# EAGLE design CON_Board_v1 (EAGLE 7.3.0)
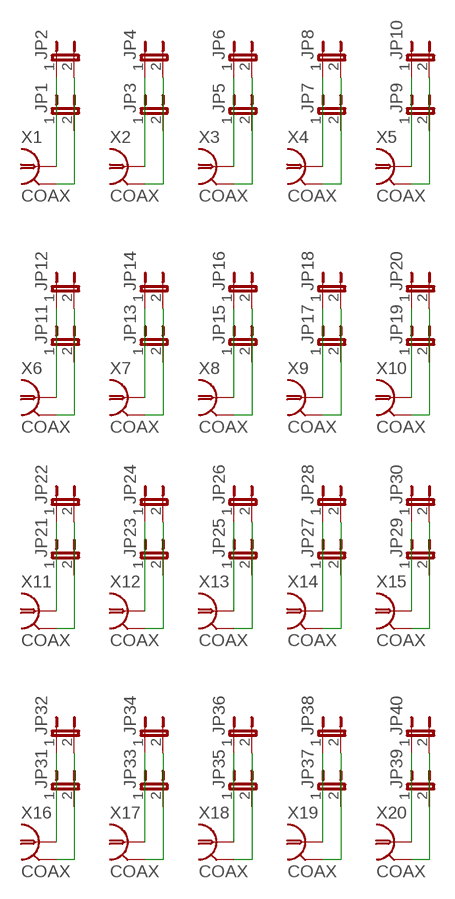
[diagram p0: schematic, sheet 1]

## Parts
JP1  JP1E  [JP1]
JP2  JP1E  [JP1]
JP3  JP1E  [JP1]
JP4  JP1E  [JP1]
JP5  JP1E  [JP1]
JP6  JP1E  [JP1]
JP7  JP1E  [JP1]
JP8  JP1E  [JP1]
JP9  JP1E  [JP1]
JP10  JP1E  [JP1]
JP11  JP1E  [JP1]
JP12  JP1E  [JP1]
JP13  JP1E  [JP1]
JP14  JP1E  [JP1]
JP15  JP1E  [JP1]
JP16  JP1E  [JP1]
JP17  JP1E  [JP1]
JP18  JP1E  [JP1]
JP19  JP1E  [JP1]
JP20  JP1E  [JP1]
JP21  JP1E  [JP1]
JP22  JP1E  [JP1]
JP23  JP1E  [JP1]
JP24  JP1E  [JP1]
JP25  JP1E  [JP1]
JP26  JP1E  [JP1]
JP27  JP1E  [JP1]
JP28  JP1E  [JP1]
JP29  JP1E  [JP1]
JP30  JP1E  [JP1]
JP31  JP1E  [JP1]
JP32  JP1E  [JP1]
JP33  JP1E  [JP1]
JP34  JP1E  [JP1]
JP35  JP1E  [JP1]
JP36  JP1E  [JP1]
JP37  JP1E  [JP1]
JP38  JP1E  [JP1]
JP39  JP1E  [JP1]
JP40  JP1E  [JP1]
X1  COAX  31-5329-52RFX31-5329-52RFX  [31-5329]
X2  COAX  31-5329-52RFX31-5329-52RFX  [31-5329]
X3  COAX  31-5329-52RFX31-5329-52RFX  [31-5329]
X4  COAX  31-5329-52RFX31-5329-52RFX  [31-5329]
X5  COAX  31-5329-52RFX31-5329-52RFX  [31-5329]
X6  COAX  31-5329-52RFX31-5329-52RFX  [31-5329]
X7  COAX  31-5329-52RFX31-5329-52RFX  [31-5329]
X8  COAX  31-5329-52RFX31-5329-52RFX  [31-5329]
X9  COAX  31-5329-52RFX31-5329-52RFX  [31-5329]
X10  COAX  31-5329-52RFX31-5329-52RFX  [31-5329]
X11  COAX  31-5329-52RFX31-5329-52RFX  [31-5329]
X12  COAX  31-5329-52RFX31-5329-52RFX  [31-5329]
X13  COAX  31-5329-52RFX31-5329-52RFX  [31-5329]
X14  COAX  31-5329-52RFX31-5329-52RFX  [31-5329]
X15  COAX  31-5329-52RFX31-5329-52RFX  [31-5329]
X16  COAX  31-5329-52RFX31-5329-52RFX  [31-5329]
X17  COAX  31-5329-52RFX31-5329-52RFX  [31-5329]
X18  COAX  31-5329-52RFX31-5329-52RFX  [31-5329]
X19  COAX  31-5329-52RFX31-5329-52RFX  [31-5329]
X20  COAX  31-5329-52RFX31-5329-52RFX  [31-5329]

## Nets
N$1: JP1.1 JP2.1 X1.1
N$2: JP1.2 JP2.2 X1.2 X1.3 X1.4 X1.5
N$3: JP3.1 JP4.1 X2.1
N$4: JP3.2 JP4.2 X2.2 X2.3 X2.4 X2.5
N$5: JP5.1 JP6.1 X3.1
N$6: JP5.2 JP6.2 X3.2 X3.3 X3.4 X3.5
N$7: JP7.1 JP8.1 X4.1
N$8: JP7.2 JP8.2 X4.2 X4.3 X4.4 X4.5
N$9: JP9.1 JP10.1 X5.1
N$10: JP9.2 JP10.2 X5.2 X5.3 X5.4 X5.5
N$11: JP11.1 JP12.1 X6.1
N$12: JP11.2 JP12.2 X6.2 X6.3 X6.4 X6.5
N$13: JP13.1 JP14.1 X7.1
N$14: JP13.2 JP14.2 X7.2 X7.3 X7.4 X7.5
N$15: JP15.1 JP16.1 X8.1
N$16: JP15.2 JP16.2 X8.2 X8.3 X8.4 X8.5
N$17: JP17.1 JP18.1 X9.1
N$18: JP17.2 JP18.2 X9.2 X9.3 X9.4 X9.5
N$19: JP19.1 JP20.1 X10.1
N$20: JP19.2 JP20.2 X10.2 X10.3 X10.4 X10.5
N$21: JP21.1 JP22.1 X11.1
N$22: JP21.2 JP22.2 X11.2 X11.3 X11.4 X11.5
N$23: JP23.1 JP24.1 X12.1
N$24: JP23.2 JP24.2 X12.2 X12.3 X12.4 X12.5
N$25: JP25.1 JP26.1 X13.1
N$26: JP25.2 JP26.2 X13.2 X13.3 X13.4 X13.5
N$27: JP27.1 JP28.1 X14.1
N$28: JP27.2 JP28.2 X14.2 X14.3 X14.4 X14.5
N$29: JP29.1 JP30.1 X15.1
N$30: JP29.2 JP30.2 X15.2 X15.3 X15.4 X15.5
N$31: JP31.1 JP32.1 X16.1
N$32: JP31.2 JP32.2 X16.2 X16.3 X16.4 X16.5
N$33: JP33.1 JP34.1 X17.1
N$34: JP33.2 JP34.2 X17.2 X17.3 X17.4 X17.5
N$35: JP35.1 JP36.1 X18.1
N$36: JP35.2 JP36.2 X18.2 X18.3 X18.4 X18.5
N$37: JP37.1 JP38.1 X19.1
N$38: JP37.2 JP38.2 X19.2 X19.3 X19.4 X19.5
N$39: JP39.1 JP40.1 X20.1
N$40: JP39.2 JP40.2 X20.2 X20.3 X20.4 X20.5

## Library data of the parts
JP1-JP40 = jumper:JP1E: JUMPER
X1-X20 = Amphenol-coax-connector:31-5329-52RFX; OC_FARNELL: unknown; OC_NEWARK: unknown

## Board
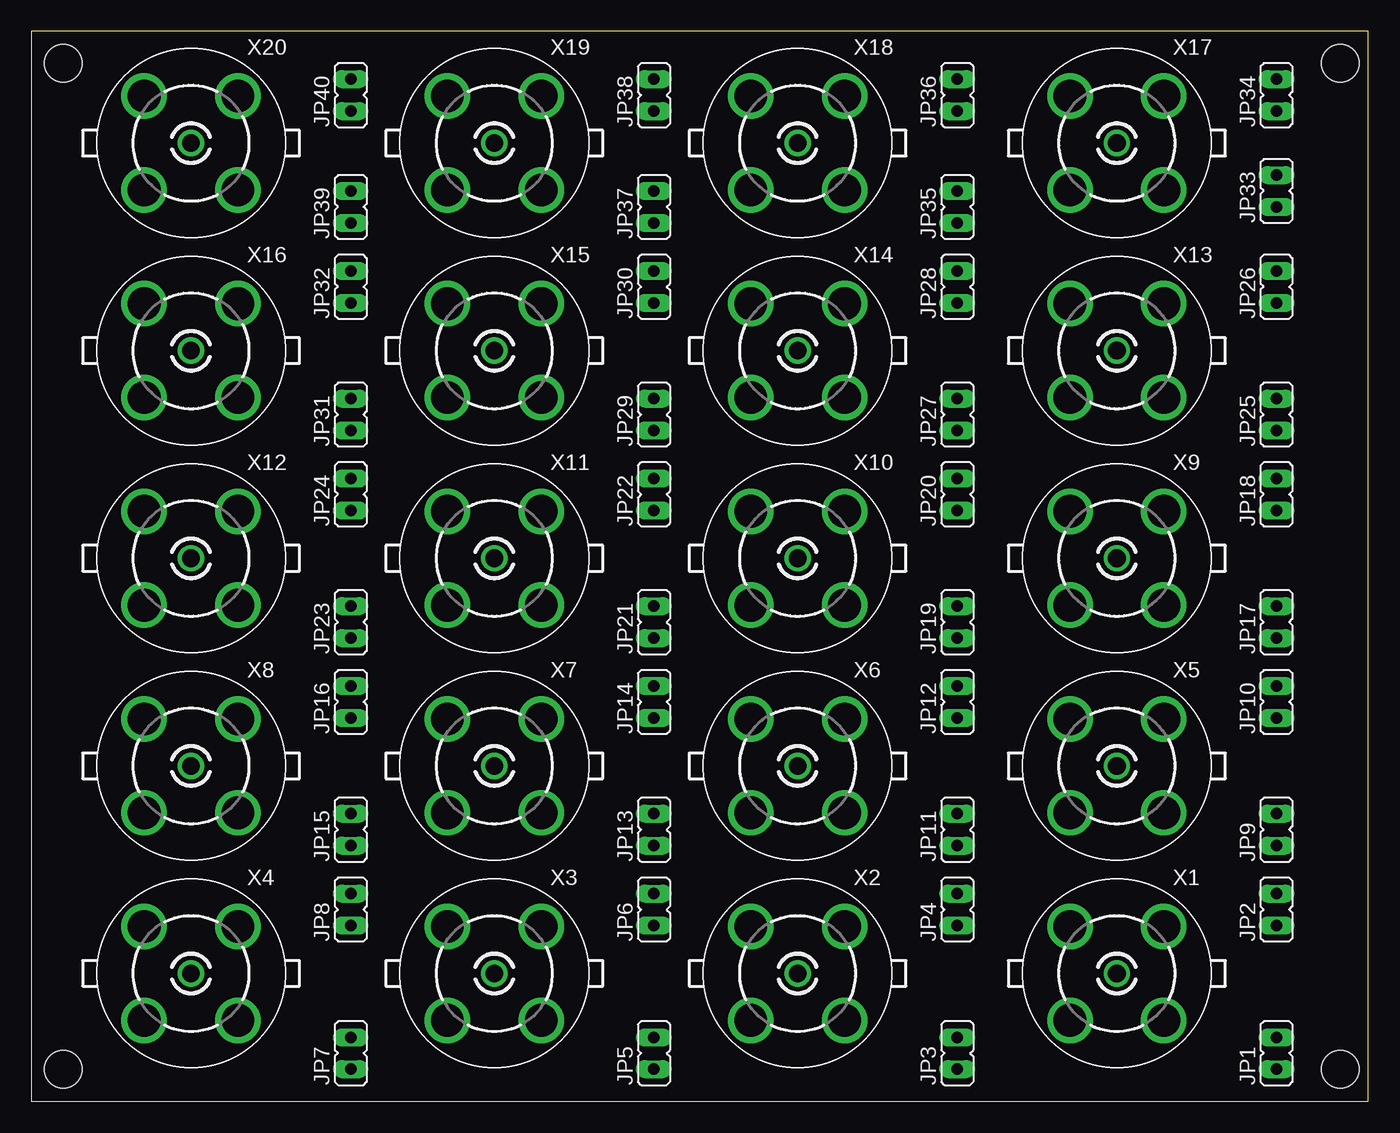
[diagram p1: board, top side]
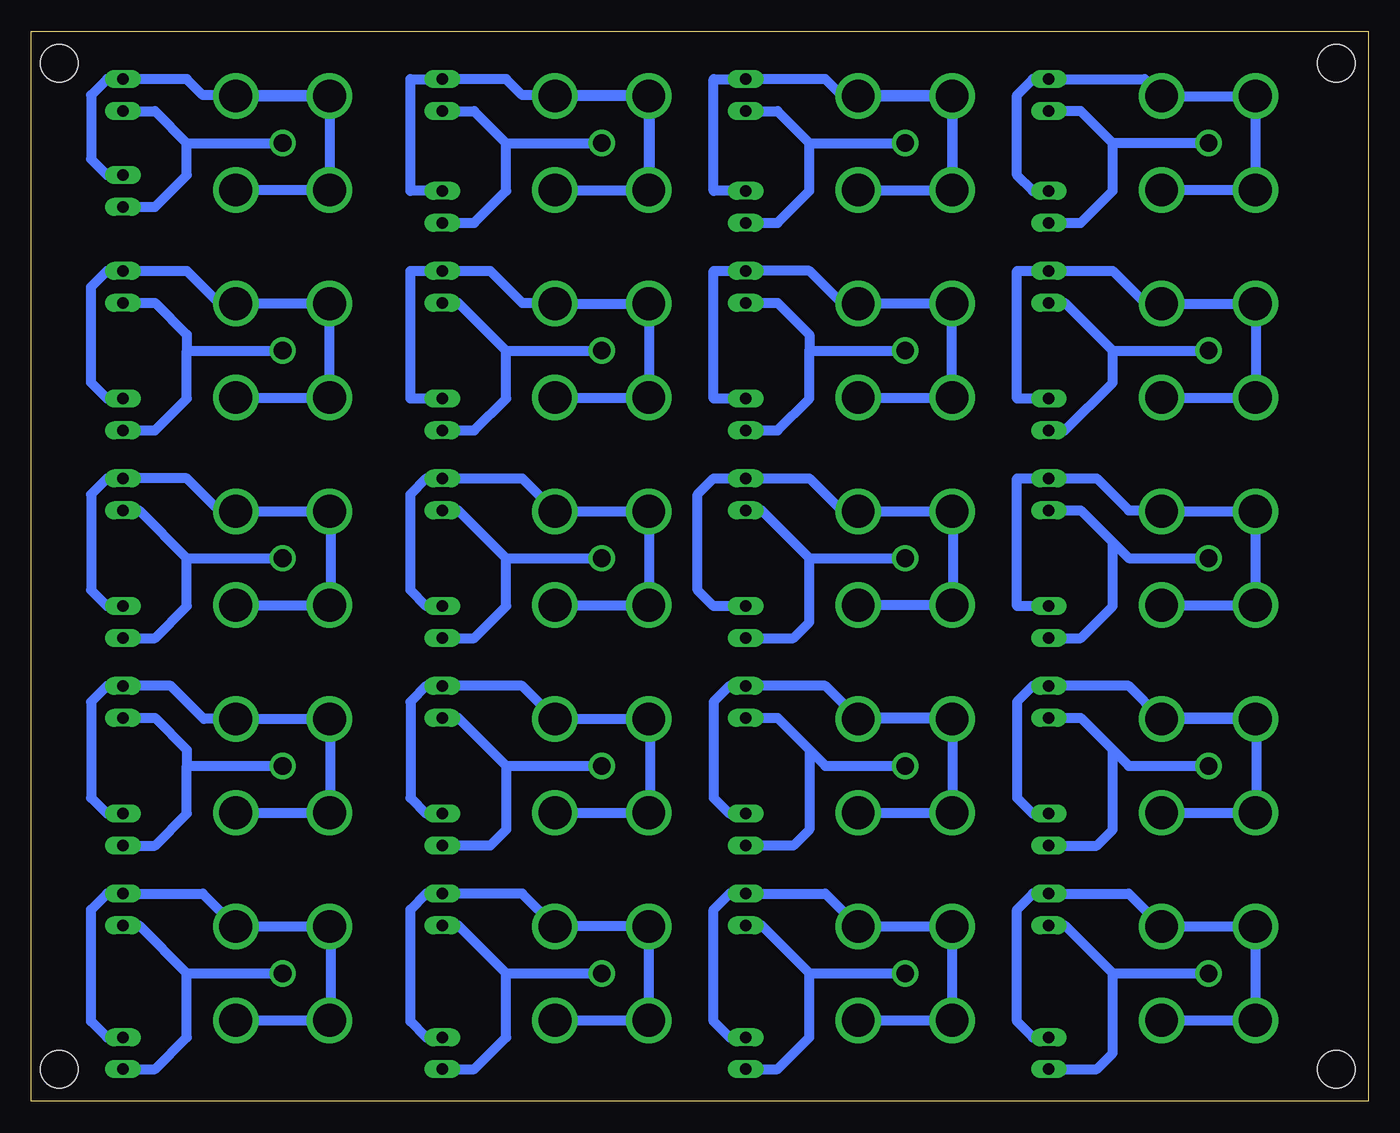
[diagram p2: board, bottom side, seen from below]

Size 106.35 x 85.08 mm. Coordinates in mm from the lower left corner, seen from the top.
Outline: 0,0 106.35,0 106.35,85.08 0,85.08 0,0
Copper layers (1*16): Top 0.035mm / dielectric 1.5mm / Bottom 0.035mm
Design rules "default": minimum track width 10mil, minimum drill 24mil, track to track 8mil, track to pad 8mil, pad to pad 8mil, via to via 8mil, smd to smd 8mil, copper to edge 40mil, drill to drill 8mil, minimum pad ring 10mil, minimum via ring 8mil, stop-mask expansion 4mil, vias tented up to drill 0mil, thermal gap 10mil
Holes 3 mm at 104.14,82.55 104.14,2.54 2.54,82.55 2.54,2.54

### Footprints (pad centres in the part's own frame; a part is rotated, then mirrored left to right if it is on the bottom)
JP1 = drill 0.914 long: 1 0,-1.27; 2 0,1.27
31-5329 = drill 1.4: 1 0,0 | drill 2.6: 2 3.734,3.734; 3 -3.734,3.734; 4 -3.734,-3.734; 5 3.734,-3.734

### Placement (x,y rotation side)
JP1  99.06,3.81 0 top
JP2  99.06,15.24 0 top
JP3  73.66,3.81 0 top
JP4  73.66,15.24 0 top
JP5  49.53,3.81 0 top
JP6  49.53,15.24 0 top
JP7  25.4,3.81 0 top
JP8  25.4,15.24 0 top
JP9  99.06,21.59 0 top
JP10  99.06,31.75 0 top
JP11  73.66,21.59 0 top
JP12  73.66,31.75 0 top
JP13  49.53,21.59 0 top
JP14  49.53,31.75 0 top
JP15  25.4,21.59 0 top
JP16  25.4,31.75 0 top
JP17  99.06,38.1 0 top
JP18  99.06,48.26 0 top
JP19  73.66,38.1 0 top
JP20  73.66,48.26 0 top
JP21  49.53,38.1 0 top
JP22  49.53,48.26 0 top
JP23  25.4,38.1 0 top
JP24  25.4,48.26 0 top
JP25  99.06,54.61 0 top
JP26  99.06,64.77 0 top
JP27  73.66,54.61 0 top
JP28  73.66,64.77 0 top
JP29  49.53,54.61 0 top
JP30  49.53,64.77 0 top
JP31  25.4,54.61 0 top
JP32  25.4,64.77 0 top
JP33  99.06,72.39 0 top
JP34  99.06,80.01 0 top
JP35  73.66,71.12 0 top
JP36  73.66,80.01 0 top
JP37  49.53,71.12 0 top
JP38  49.53,80.01 0 top
JP39  25.4,71.12 0 top
JP40  25.4,80.01 0 top
X1  86.36,10.16 0 top
X2  60.96,10.16 0 top
X3  36.83,10.16 0 top
X4  12.7,10.16 0 top
X5  86.36,26.67 0 top
X6  60.96,26.67 0 top
X7  36.83,26.67 0 top
X8  12.7,26.67 0 top
X9  86.36,43.18 0 top
X10  60.96,43.18 0 top
X11  36.83,43.18 0 top
X12  12.7,43.18 0 top
X13  86.36,59.69 0 top
X14  60.96,59.69 0 top
X15  36.83,59.69 0 top
X16  12.7,59.69 0 top
X17  86.36,76.2 0 top
X18  60.96,76.2 0 top
X19  36.83,76.2 0 top
X20  12.7,76.2 0 top

### Tracks (layer width: path | path; a pad name or v marks a point on that pad's centre or on a via)
N$1
  Bottom 0.813: JP2.1 97.79,13.97 93.98,10.16 | 93.98,10.16 X1.1 | JP1.1 96.52,2.54 93.98,5.08 93.98,10.16
N$2
  Bottom 0.813: X1.5 X1.4 82.55,6.5 82.55,13.97 X1.3 X1.2 92.71,16.51 JP2.2 100.33,16.51 101.6,15.24 101.6,6.35 100.33,5.08 JP1.2
N$3
  Bottom 0.813: JP4.1 72.39,13.97 68.58,10.16 | 68.58,10.16 X2.1 | JP3.1 71.12,2.54 68.58,5.08 68.58,10.16
N$4
  Bottom 0.813: X2.4 X2.3 X2.2 67.31,16.51 JP4.2 74.93,16.51 76.2,15.24 76.2,6.35 74.93,5.08 JP3.2 | X2.5 X2.4 | 57.15,6.35 X2.4
N$5
  Bottom 0.813: JP6.1 48.26,13.97 44.45,10.16 | 44.45,10.16 X3.1 | JP5.1 46.99,2.54 44.45,5.08 44.45,10.16
N$6
  Bottom 0.813: X3.3 X3.2 43.18,16.51 JP6.2 50.8,16.51 52.07,15.24 52.07,6.35 50.8,5.08 JP5.2 | 33.02,13.97 X3.3 | X3.3 X3.4 X3.5
N$7
  Bottom 0.813: JP8.1 24.13,13.97 20.32,10.16 | 20.32,10.16 X4.1 | JP7.1 21.59,2.54 20.32,3.81 20.32,10.16
N$8
  Bottom 0.813: X4.5 X4.4 X4.3 X4.2 19.05,16.51 JP8.2 26.67,16.51 27.94,15.24 27.94,6.35 26.67,5.08 JP7.2
N$9
  Bottom 0.813: JP10.1 96.52,30.48 93.98,27.94 93.98,26.67 | 93.98,26.67 X5.1 | JP9.1 96.52,20.32 93.98,22.86 93.98,26.67
N$10
  Bottom 0.813: JP9.2 100.33,22.86 101.6,24.13 101.6,31.75 100.33,33.02 JP10.2 95.25,33.02 92.63,30.4 X5.2 X5.3 82.55,30.33 82.55,22.86 X5.4 X5.5
N$11
  Bottom 0.813: JP12.1 72.39,30.48 68.58,26.67 | 68.58,26.67 X6.1 | 68.58,26.67 68.58,21.59 69.85,20.32 JP11.1
N$12
  Bottom 0.813: JP11.2 74.93,22.86 76.2,24.13 76.2,31.75 74.93,33.02 JP12.2 67.31,33.02 X6.2 X6.3 57.15,30.48 57.15,22.86 X6.4 X6.5
N$13
  Bottom 0.813: X7.1 43.18,26.67 44.45,27.94 | JP14.1 46.99,30.48 44.45,27.94 | 44.45,27.94 44.45,21.59 45.72,20.32 JP13.1
N$14
  Bottom 0.813: JP13.2 50.8,22.86 52.07,24.13 52.07,31.75 50.8,33.02 JP14.2 43.18,33.02 40.64,30.48 33.02,30.48 33.02,30.33 | X7.2 X7.3 33.02,30.33 | 33.02,30.33 33.02,22.86 X7.4 X7.5
N$15
  Bottom 0.813: JP16.1 22.86,30.48 20.32,27.94 | 20.32,27.94 19.05,26.67 X8.1 | JP15.1 21.59,20.32 20.32,21.59 20.32,27.94
N$16
  Bottom 0.813: JP15.2 26.67,22.86 27.94,24.13 27.94,31.75 26.67,33.02 JP16.2 19.05,33.02 16.51,30.48 8.89,30.48 | X8.2 X8.3 8.89,30.48 | 8.89,30.48 8.89,23.01 | 8.89,23.01 X8.4 | X8.5 X8.4 | X8.4 8.89,22.86 8.89,23.01
N$17
  Bottom 0.813: JP18.1 97.79,46.99 93.98,43.18 | 93.98,43.18 X9.1 | JP17.1 96.52,36.83 93.98,39.37 93.98,43.18
N$18
  Bottom 0.813: JP17.2 100.33,39.37 101.6,40.64 101.6,48.26 100.33,49.53 JP18.2 93.98,49.53 91.36,46.91 X9.2 X9.3 82.55,46.99 82.55,39.52 X9.4 X9.5
N$19
  Bottom 0.813: JP20.1 72.39,46.99 68.58,43.18 | 68.58,43.18 X10.1 | JP19.1 71.12,36.83 68.58,39.37 68.58,43.18
N$20
  Bottom 0.813: X10.5 X10.4 X10.3 X10.2 67.31,49.53 JP20.2 74.93,49.53 76.2,48.26 76.2,40.64 74.93,39.37 JP19.2
N$21
  Bottom 0.813: JP22.1 48.26,46.99 44.45,43.18 | 44.45,43.18 X11.1 | JP21.1 45.72,36.83 44.45,38.1 44.45,43.18
N$22
  Bottom 0.813: 40.64,39.37 X11.5 X11.4 33.02,39.52 33.02,46.99 X11.3 X11.2 40.64,46.99 41.91,46.99 44.45,49.53 JP22.2 52.07,49.53 53.34,48.26 53.34,40.64 52.07,39.37 JP21.2
N$23
  Bottom 0.813: JP24.1 22.86,46.99 20.32,44.45 | 20.32,44.45 19.05,43.18 X12.1 | JP23.1 22.86,36.83 20.32,39.37 20.32,44.45
N$24
  Bottom 0.813: X12.5 X12.4 X12.3 X12.2 16.51,46.99 19.05,46.99 21.59,49.53 JP24.2 27.94,49.53 27.94,39.37 JP23.2
N$25
  Bottom 0.813: JP25.1 96.52,53.34 93.98,55.88 93.98,59.69 | JP26.1 96.52,63.5 93.98,60.96 93.98,59.69 | 93.98,59.69 X13.1
N$26
  Bottom 0.813: X13.5 X13.4 X13.3 X13.2 90.17,63.5 91.44,63.5 93.98,66.04 JP26.2 100.33,66.04 101.6,64.77 101.6,57.15 100.33,55.88 JP25.2
N$27
  Bottom 0.813: JP28.1 72.39,63.5 68.58,59.69 | 68.58,59.69 X14.1 | JP27.1 71.12,53.34 68.58,55.88 68.58,59.69
N$28
  Bottom 0.813: X14.5 X14.4 X14.3 X14.2 64.77,63.5 67.31,63.5 69.85,66.04 JP28.2 76.2,66.04 76.2,55.88 JP27.2
N$29
  Bottom 0.813: JP30.1 46.99,63.5 44.45,60.96 44.45,59.69 | 44.45,59.69 X15.1 | JP29.1 46.99,53.34 44.45,55.88 44.45,59.69
N$30
  Bottom 0.813: X15.5 X15.4 X15.3 X15.2 41.83,63.42 44.45,66.04 JP30.2 52.07,66.04 52.07,55.88 JP29.2
N$31
  Bottom 0.813: JP32.1 24.13,63.5 20.32,59.69 | 20.32,59.69 X16.1 | JP31.1 24.13,53.34 20.32,57.15 20.32,59.69
N$32
  Bottom 0.813: 16.51,55.88 X16.5 X16.4 8.89,55.88 8.89,63.35 X16.3 X16.2 16.51,63.5 17.78,63.5 20.32,66.04 JP32.2 27.94,66.04 27.94,55.88 JP31.2
N$33
  Bottom 0.813: JP34.1 96.52,78.74 93.98,76.2 | 93.98,76.2 X17.1 | JP33.1 96.52,71.12 93.98,73.66 93.98,76.2
N$34
  Bottom 0.813: X17.2 X17.3 | X17.3 82.55,80.01 92.71,80.01 93.98,81.28 JP34.2 100.33,81.28 101.6,80.01 101.6,74.93 100.33,73.66 JP33.2 | X17.3 X17.4 | X17.4 82.55,72.39 | X17.4 X17.5
N$35
  Bottom 0.813: JP36.1 71.12,78.74 68.58,76.2 | 68.58,76.2 X18.1 | JP35.1 71.12,69.85 68.58,72.39 68.58,76.2
N$36
  Bottom 0.813: X18.4 X18.3 X18.2 64.77,80.01 | JP35.2 76.2,72.39 76.2,81.28 JP36.2 68.58,81.28 67.31,80.01 57.15,80.01 57.15,72.39 X18.4 | X18.5 X18.4
N$37
  Bottom 0.813: JP38.1 46.99,78.74 44.45,76.2 | 44.45,76.2 X19.1 | JP37.1 46.99,69.85 44.45,72.39 44.45,76.2
N$38
  Bottom 0.813: X19.4 X19.3 X19.2 | JP37.2 52.07,72.39 52.07,81.28 JP38.2 43.18,81.28 41.91,80.01 33.02,80.01 33.02,72.39 X19.4 | X19.5 X19.4
N$39
  Bottom 0.813: X20.1 20.32,76.2 | 20.32,76.2 22.86,78.74 JP40.1 | JP39.1 22.86,69.85 20.32,72.39 20.32,76.2
N$40
  Bottom 0.813: X20.5 X20.4 X20.3 X20.2 17.78,81.28 JP40.2 26.67,81.28 27.94,80.01 27.94,73.66 26.67,72.39 JP39.2